# EAGLE design Fingerprint lock_1.4 (EAGLE 9.6.2)

## Sheet 1 of 2
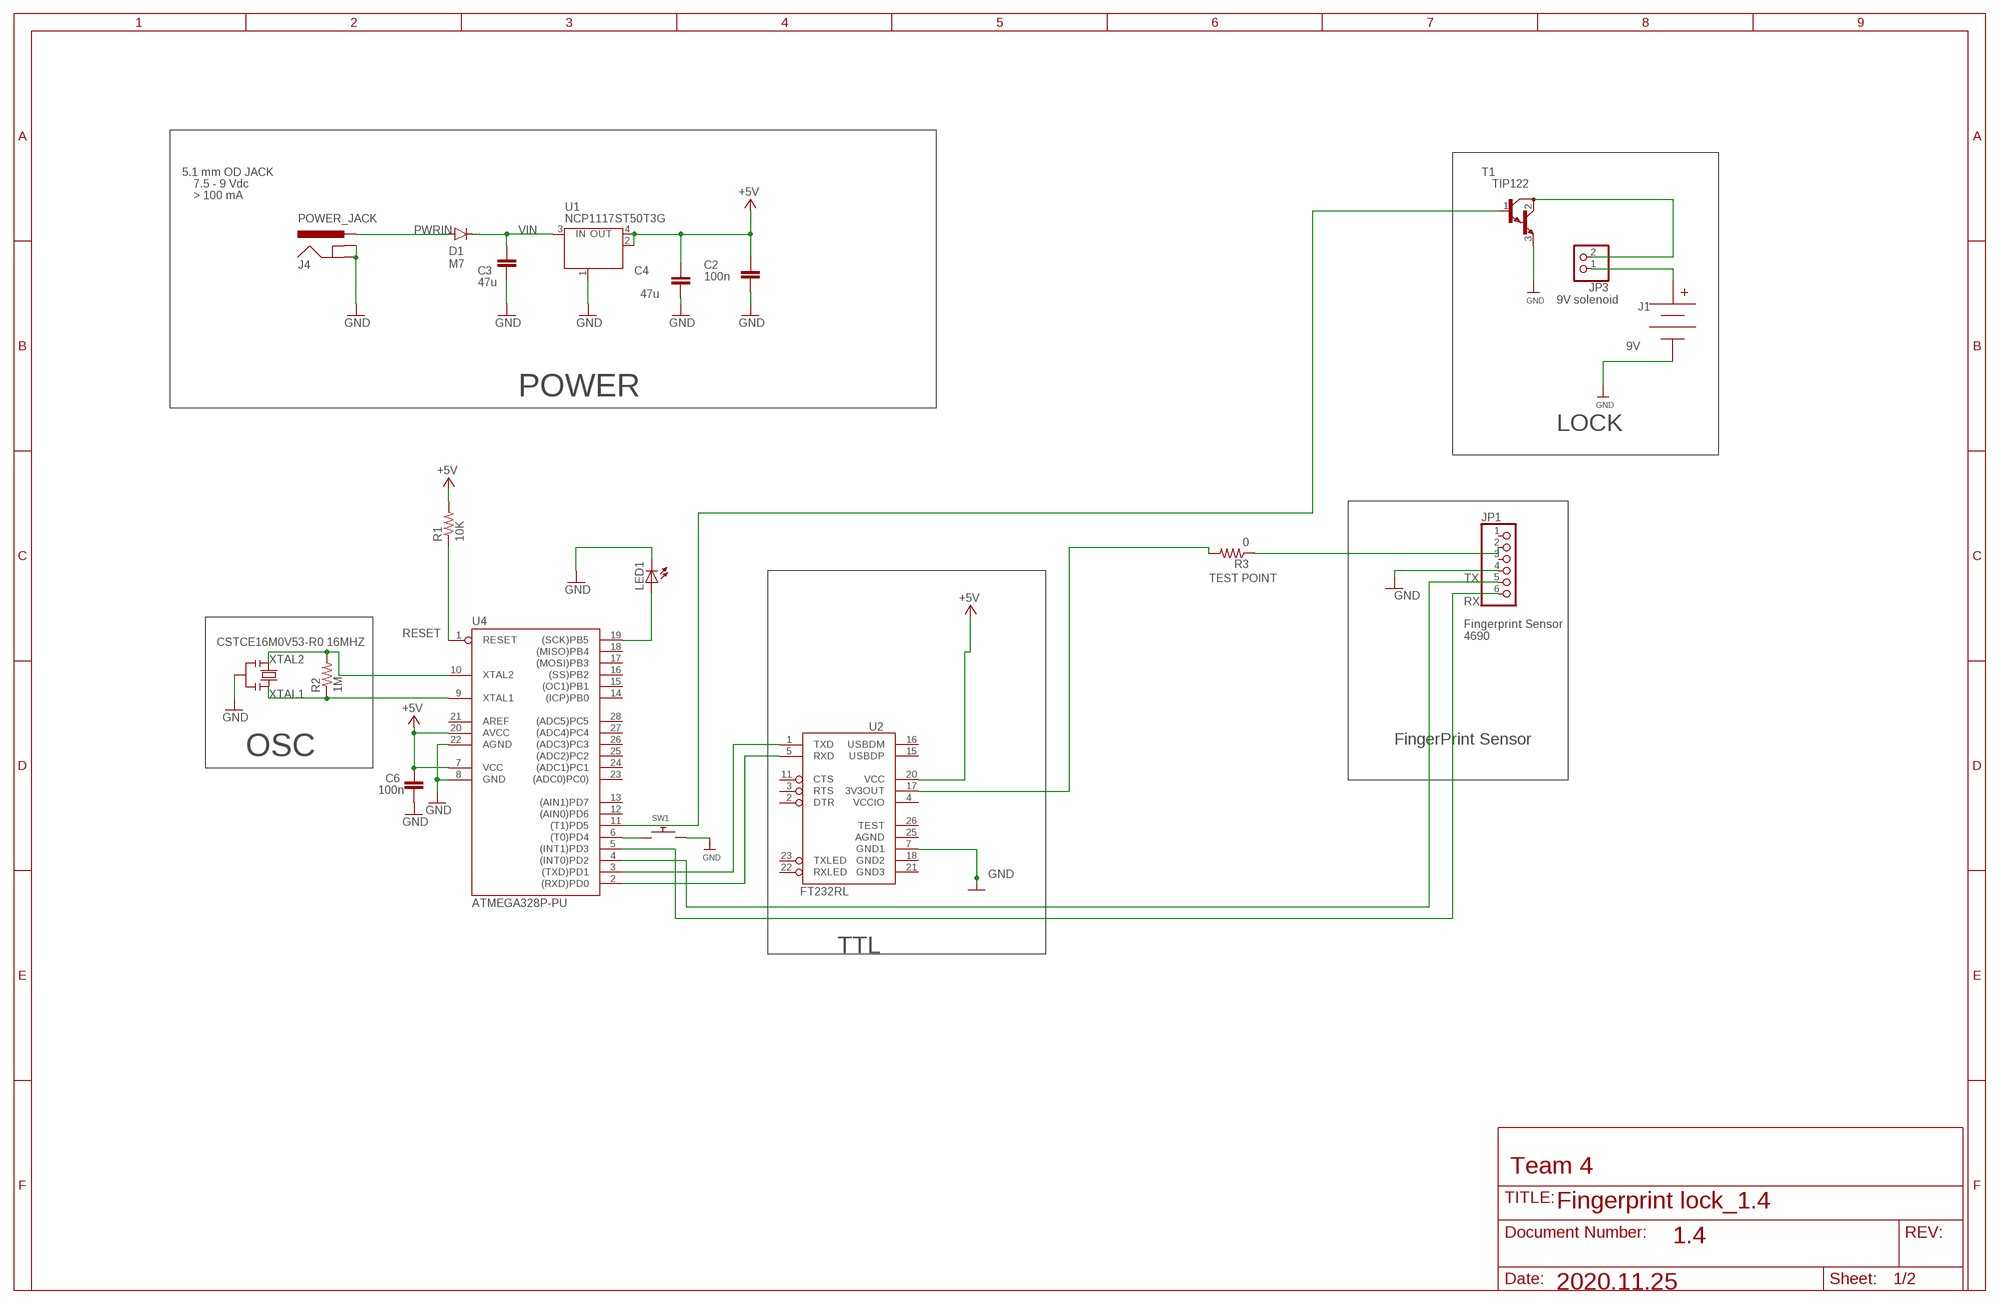
[diagram p0: schematic, sheet 1]

### Parts
C2  100n  C-EUC0805  [C0805]
C3  47u  C-EUC0805  [C0805]
C4  47u  C-EUC0805  [C0805]
C6  100n  C-EUC0805  [C0805]
D1  M7  DIODE-SMB  [SMB]
J1  9V  BC9VPC  [BC9VPC]
J4  POWER_JACK  [POWER_JACK_PTH]
JP1  PINHD-1X6B  [1X06-BIG]
JP3  PINHD-1X2  [1X02]
LED1  LEDB155  [Q62902-B155]
R1  10K  R-US_R0805  [R0805]
R2  1M  R-US_R0805  [R0805]
R3  0  R-US_R0805  [R0805]
SW1  SWITCH_PUSHBUTTONEVQ-PE  [TACT_PANA-EVQ]
T1  TIP122  [TO220]
U1  NCP1117ST50T3G  MC33269ST-3.3T3  [SOT223]
U2  FT232RL  FT232RL-BASICSSOP  [SSOP28DB]
U4  ATMEGA328P-PU  [DIL28-3]
X1  CSTCE16M0V53-R0 16MHZ  RESONATORMU  [RESONATOR]

### Nets
9V: J1.V+ JP3.1
+5V: C2.2 C4.2 C6.2 R1.2 U1.2(OUT) U1.4(OUT) U2.20(VCC) U4.7(VCC) U4.20(AVCC)
GND [gnd]: C2.1 C3.1 C4.1 C6.1 J1.V- J4.GND J4.GNDBREAK JP1.4 LED1.K(C) SW1.P$2 T1.3(E) U1.1(GND/ADJ) U2.7(GND1) U4.8(GND) U4.22(AGND) X1.2
LED: LED1.A U4.19((SCK)PB5)
LOCK: T1.1(B) U4.11((T1)PD5)
N$1: JP1.6 U4.5((INT1)PD3)
N$2: JP1.2 R3.1
N$3: U2.5(RXD) U4.2((RXD)PD0)
N$4: U2.1(TXD) U4.3((TXD)PD1)
N$5: R3.2 U2.17(3V3OUT)
N$6: JP3.2 T1.2(C)
N$7: SW1.P$1 U4.6((T0)PD4)
PWRIN [power]: D1.A J4.PWR
RESET: R1.1 U4.1(RESET)
TXD: JP1.5 U4.4((INT0)PD2)
VIN [power]: C3.2 D1.C U1.3(IN)
XTAL1: R2.1 U4.9(XTAL1) X1.3
XTAL2: R2.2 U4.10(XTAL2) X1.1
Unconnected: JP1.1 JP1.3 U2.2(DTR) U2.3(RTS) U2.11(CTS) U2.15(USBDP) U2.16(USBDM) U2.22(RXLED) U2.23(TXLED) U2.26(TEST) U4.12((AIN0)PD6) U4.13((AIN1)PD7) U4.14((ICP)PB0) U4.15((OC1)PB1) U4.16((SS)PB2) U4.17((MOSI)PB3) U4.18((MISO)PB4) U4.21(AREF) U4.23((ADC0)PC0)) U4.24((ADC1)PC1) U4.25((ADC2)PC2) U4.26((ADC3)PC3) U4.27((ADC4)PC4) U4.28((ADC5)PC5)

### Notes on the sheet
- 5.1 mm OD JACK
- 7.5 - 9 Vdc
- > 100 mA
- 9V solenoid
- POWER
- LOCK
- TEST POINT | TX
- RX
- Fingerprint Sensor   
  4690
- FingerPrint Sensor
- OSC
- TTL
- Team 4
- Fingerprint lock_1.4
- 1.4
- 2020.11.25

## Sheet 2 of 2

## Power pins joined to a net without a drawn wire
AGND: U2.25(AGND)
GND2: U2.18(GND2)
GND3: U2.21(GND3)
VCCIO: U2.4(VCCIO)

## Library data of the parts
C2-C4 C6 = rcl:C-EU: CAPACITOR, European symbol; SPICEPREFIX: C
D1 = diode:DIODE-: DIODE
J1 = SparkFun-Connectors:BC9VPC: 9V Battery Holder - PC Mount Standard and Kit footprints included SparkFun Products: SparkFun SparkPunk Sound Kit <https://www.sparkfun.com/products/11177> SparkFun SparkPunk Sequencer Kit <https://www.sparkfun.com/products/12707>; PROD_ID: BATT-10855
J4 = SparkFun-Connectors:POWER_JACK: Power Jack Connector This is the standard 5.5mm barrel jack for power. The PTH is the most common, proven, reliable, footprint. The Slot footprint only works if the mill layer is transmitted to the PCB fab house so be warned. Here are the connectors we sell at SparkFun: DC Barrel Power Jack/Connector <https://www.sparkfun.com/products/119> (PRT-00119) DC Barrel Power Jack/Connector (SMD) <https://www.sparkfun.com/products/12748> (PRT-12748) DC Barrel Jack Adapter - Breadboard Compatible <https://www.sparkfun.com/products/10811> (PRT-10811) It is used on this SparkFun product (and many, many others): SparkFun RedBoard - Programmed with Arduino <https://www.sparkfun.com/products/12757> (DEV-12757) Also, if you need a mating power supply or connector, please check these out: Wall Adapter Power Supply - 9VDC 650mA <https://www.sparkfun.com/products/298> (TOL-00298) DC Barrel Jack Adapter - Male <https://www.sparkfun.com/products/10287> (PRT-10287); PROD_ID: CONN-08197
JP1 = adafruit:PINHD-1X6: PIN HEADER
JP3 = pinhead:PINHD-1X2: PIN HEADER
LED1 = adafruit:LED: LED OSRAM: - CHIPLED LG R971, LG N971, LY N971, LG Q971, LY Q971, LO R971, LY R971 LH N974, LH R974 LS Q976, LO Q976, LY Q976 LO Q996 - Hyper CHIPLED LW Q18S LB Q993, LB Q99A, LB R99A - SideLED LS A670, LO A670, LY A670, LG A670, LP A670 LB A673, LV A673, LT A673, LW A673 LH A674 LY A675 LS A676, LA A676, LO A676, LY A676, LW A676 LS A679, LY A679, LG A679 - Hyper Micro SIDELED® LS Y876, LA Y876, LO Y876, LY Y876 LT Y87S - SmartLED LW L88C, LW L88S LB L89C, LB L89S, LG L890 LS L89K, LO L89K, LY L89K LS L896, LA L896, LO L896, LY L896 - TOPLED LS T670, LO T670, LY T670, LG T670, LP T670 LSG T670, LSP T670, LSY T670, LOP T670, LYG T670 LG T671, LOG T671, LSG T671 LB T673, LV T673, LT T673, LW T673 LH T674 LS T676, LA T676, LO T676, LY T676, LB T676, LH T676, LSB T676, LW T676 LB T67C, LV T67C, LT T67C, LS T67K, LO T67K, LY T67K, LW E67C LS E67B, LA E67B, LO E67B, LY E67B, LB E67C, LV E67C, LT E67C LW T67C LS T679, LY T679, LG T679 LS T770, LO T770, LY T770, LG T770, LP T770 LB T773, LV T773, LT T773, LW T773 LH T774 LS E675, LA E675, LY E675, LS T675 LS T776, LA T776, LO T776, LY T776, LB T776 LHGB T686 LT T68C, LB T68C - Hyper Mini TOPLED® LB M676 - Mini TOPLED Santana® LG M470 LS M47K, LO M47K, LY M47K Source: http://www.osram.convergy.de/
R1-R3 = rcl:R-US_: RESISTOR, American symbol; SPICEPREFIX: R
SW1 = adafruit:SWITCH_PUSHBUTTON: Buttons SOFTTOUCHSMD_SJ - Soft touch temporary push button (Super Junk Akihabara) Compatible with SKPMANE010 [Mouser: 688-SKPMAN] C&K_KSS = Digikey: KSS221GLFS
T1 = transistor:TIP122: NPN BIPOLAR DARLINGTON TRANSISTOR
U1 = linear:MC33269ST*: Adjustable Output Low Dropout Voltage Regulator 800 mA Source: http://www.onsemi.com/pub/Collateral/MC33269-D.PDF
U2 = SparkFun-IC-Comms:FT232RL-BASIC: FT232RL USB UART This is the simplified version of the FT232RL unit. Only what you need, nothing you don't. FT232RL 4th Generation USB UART (USB <-> Serial) Controller. Datasheet <http://www.sparkfun.com/datasheets/IC/FT232R_v104.pdf> SparkFun Products Component <https://www.sparkfun.com/products/650> (COM-00650) SparkFun RedBot Mainboard <https://www.sparkfun.com/products/12097> (ROB-12097) SparkFun FTDI Basic Breakout - 5V <https://www.sparkfun.com/products/9716> (DEV-09716) SparkFun FTDI Basic Breakout - 3.3V <https://www.sparkfun.com/products/9873> (DEV-09873) Bus Pirate - v3.6a <https://www.sparkfun.com/products/12942> (TOL-12942) SparkFun USB to Serial Breakout - FT232RL <https://www.sparkfun.com/products/12731> (BOB-12731) SparkFun PicoBoard <https://www.sparkfun.com/products/11888> (WIG-11888) SparkFun RFID USB Reader <https://www.sparkfun.com/products/9963> (SEN-09963) LilyPad FTDI Basic Breakout - 5V <https://www.sparkfun.com/products/10275> (DEV-10275) SparkFun Stepoko <https://www.sparkfun.com/products/13899> (ROB-13899); PROD_ID: IC-00870
U4 = SmartPrj:ATMEGA328P-: MICROCONTROLLER 4 Kbytes FLASH 128 bytes SRAM 256 bytes EEPROM UART 6-channel 10 bit ADC
X1 = SmartPrj:RESONATOR

## Net classes
0 default: width 0.254 mm, clearance 0.254 mm
1 power: width 0.61 mm, drill 0.61 mm, clearance 0.254 mm
2 gnd: width 0.305 mm, drill 0.559 mm, clearance 0.254 mm
3 usbvcc: width 0.508 mm, drill 0.61 mm, clearance 0.254 mm

## Board
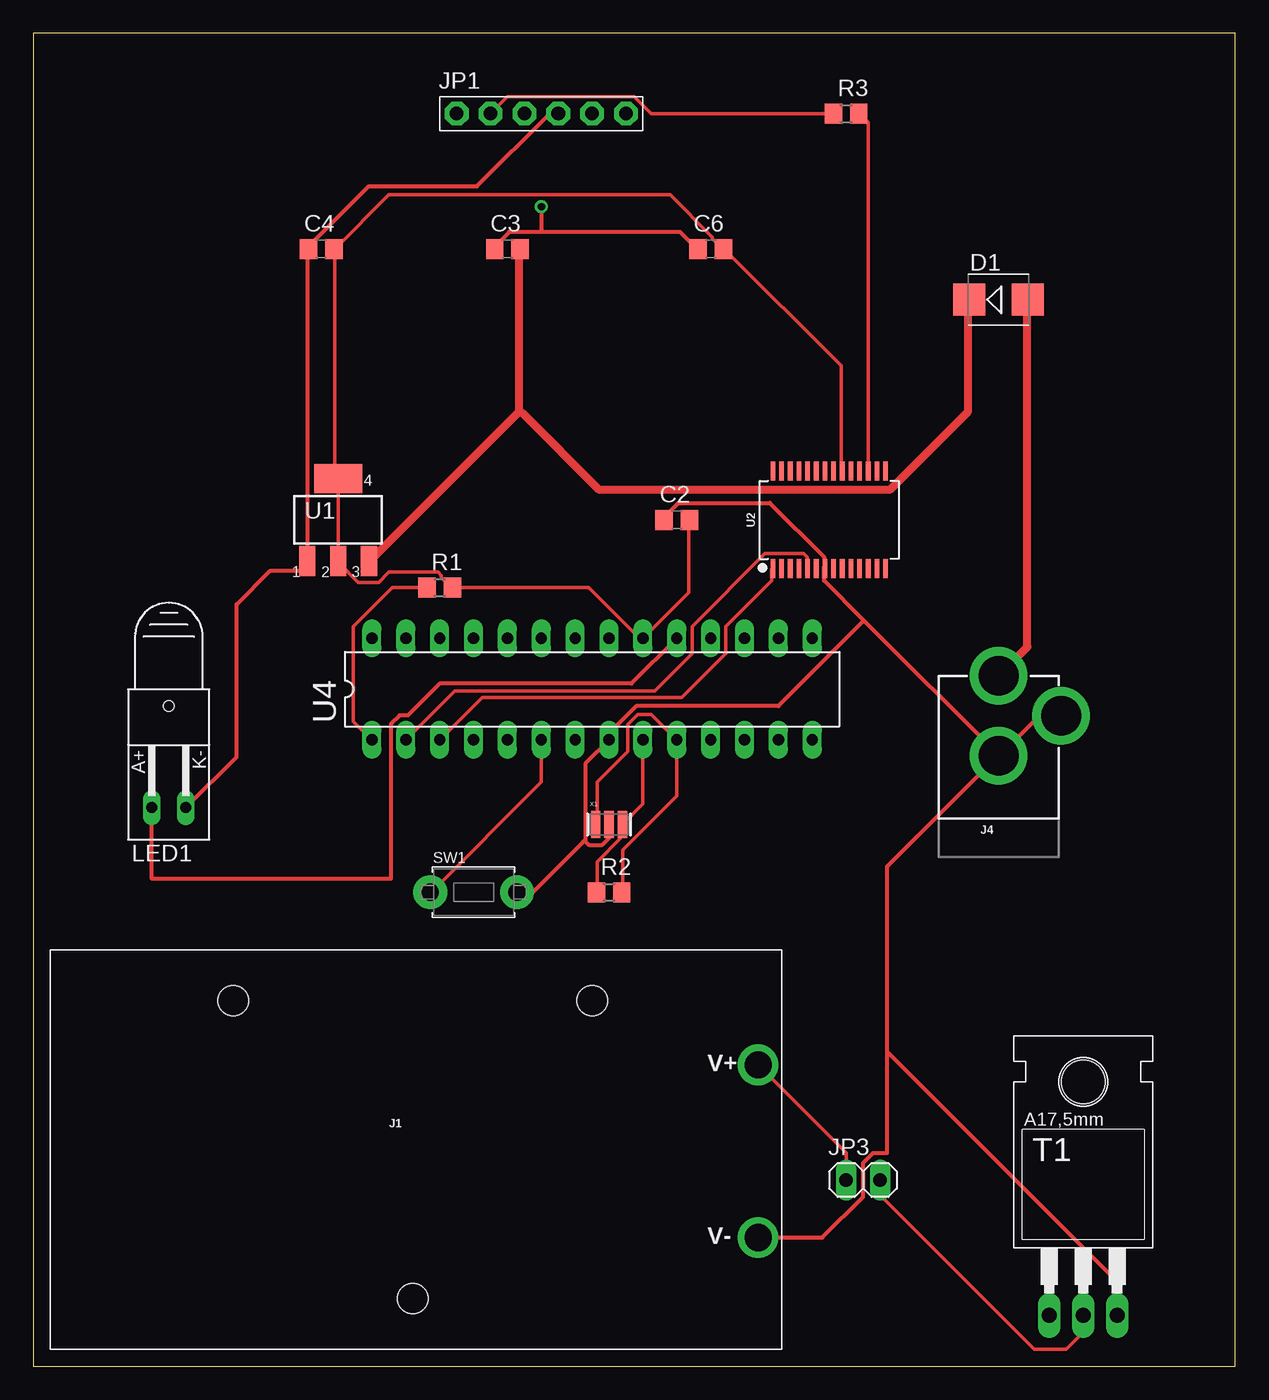
[diagram p1: board, top side]
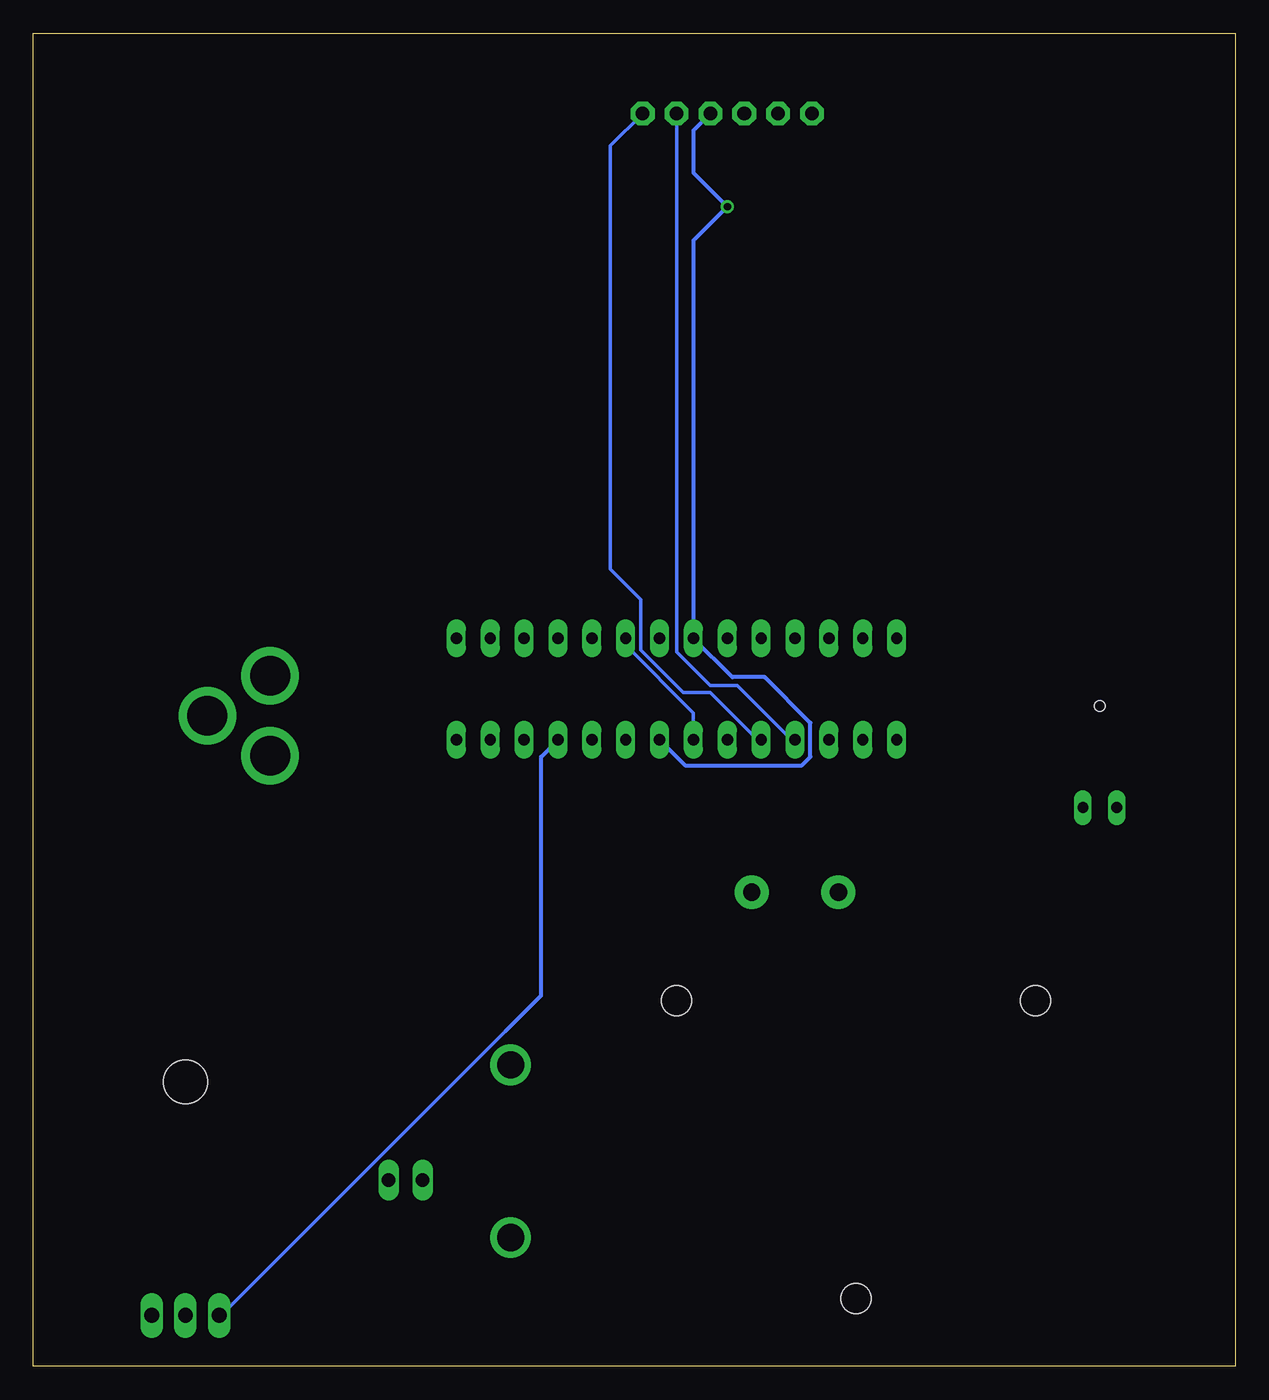
[diagram p2: board, bottom side, seen from below]

Size 90.15 x 100 mm. Coordinates in mm from the lower left corner, seen from the top.
Outline: 0,0 90.15,0 90.15,100 0,100 0,0
Copper layers (1+2*15+16): Top 0.035mm / dielectric 1.5mm / Route2 0.035mm / dielectric 0.15mm / Route15 0.035mm / dielectric 0.2mm / Bottom 0.035mm
Design rules "default *": minimum track width 6mil, minimum drill 0.35mm, track to track 6mil, track to pad 6mil, pad to pad 6mil, via to via 6mil, smd to smd 6mil, copper to edge 40mil, drill to drill 6mil, minimum pad ring 10mil, minimum via ring 8mil, stop-mask expansion 4mil, vias tented up to drill 0mil, thermal gap 10mil

### Footprints (pad centres in the part's own frame; a part is rotated, then mirrored left to right if it is on the bottom)
C0805 = smd 1.3 x 1.5: 1 -0.95,0; 2 0.95,0
SMB = smd 2.4 x 2.4: A 2.2,0; C -2.2,0
BC9VPC = drill 2.032: V+ 53.086,21.336; V- 53.086,8.382 | hole 2.286: 27.178,3.81; 13.716,26.162; 40.64,26.162
POWER_JACK_PTH = drill 2.997 pad 4.318: GND 0,7.7; GNDBREAK 4.7,10.7; PWR 0,13.7
1X06-BIG = drill 1.016 pad 1.778 octagon: 1 -6.35,0; 2 -3.81,0; 3 -1.27,0; 4 1.27,0; 5 3.81,0; 6 6.35,0
1X02 = drill 1.016 long: 1 -1.27,0; 2 1.27,0
Q62902-B155 = drill 0.813 long: A 7.62,-1.27; K 7.62,1.27 | hole 0.813: 0,0
R0805 = smd 1.3 x 1.5: 1 -0.95,0; 2 0.95,0
TACT_PANA-EVQ = drill 1.3 pad 2.54: P$1 -3.25,0; P$2 3.25,0
TO220 = drill 1.118 long: 1 -2.54,-6.35; 2 0,-6.35; 3 2.54,-6.35 | hole 3.302: 0,11.176
SOT223 = smd 1.219 x 2.235: 1 -2.311,-3.099; 2 0,-3.099; 3 2.311,-3.099 | smd 3.6 x 2.2: 4 0,3.099
SSOP28DB = smd 0.348 x 1.397: 1 -4.225,-3.656; 2 -3.575,-3.656; 3 -2.925,-3.656; 4 -2.275,-3.656; 5 -1.625,-3.656; 6 -0.975,-3.656; 7 -0.325,-3.656; 8 0.325,-3.656; 9 0.975,-3.656; 10 1.625,-3.656; 11 2.275,-3.656; 12 2.925,-3.656; 13 3.575,-3.656; 14 4.225,-3.656; 15 4.225,3.656; 16 3.575,3.656; 17 2.925,3.656; 18 2.275,3.656; 19 1.625,3.656; 20 0.975,3.656; 21 0.325,3.656; 22 -0.325,3.656; 23 -0.975,3.656; 24 -1.625,3.656; 25 -2.275,3.656; 26 -2.925,3.656; 27 -3.575,3.656; 28 -4.225,3.656
DIL28-3 = drill 0.85 pad 1.422 long: 1 -16.51,-3.81; 2 -13.97,-3.81; 3 -11.43,-3.81; 4 -8.89,-3.81; 5 -6.35,-3.81; 6 -3.81,-3.81; 7 -1.27,-3.81; 8 1.27,-3.81; 9 3.81,-3.81; 10 6.35,-3.81; 11 8.89,-3.81; 12 11.43,-3.81; 13 13.97,-3.81; 14 16.51,-3.81; 15 16.51,3.81; 16 13.97,3.81; 17 11.43,3.81; 18 8.89,3.81; 19 6.35,3.81; 20 3.81,3.81; 21 1.27,3.81; 22 -1.27,3.81; 23 -3.81,3.81; 24 -6.35,3.81; 25 -8.89,3.81; 26 -11.43,3.81; 27 -13.97,3.81; 28 -16.51,3.81
RESONATOR = smd 0.7 x 2: 1 -1,0; 2 0,0; 3 1,0

### Placement (x,y rotation side)
C2  48.26,63.5 0 top
C3  35.56,83.82 0 top
C4  21.59,83.82 0 top
C6  50.8,83.82 0 top
D1  72.39,80.01 0 top
J1  1.27,1.27 0 top
J4  72.39,38.1 0 top
JP1  38.1,93.98 0 top
JP3  62.23,13.97 0 top
LED1  10.16,49.53 270 top
R1  30.48,58.42 0 top
R2  43.18,35.56 0 top
R3  60.96,93.98 0 top
SW1  33.02,35.56 0 top
T1  78.74,10.16 0 top
U1  22.86,63.5 0 top
U2  59.69,63.5 0 top
U4  41.91,50.8 0 top
X1  43.18,40.64 0 top

### Tracks (layer width: path | path; a pad name or v marks a point on that pad's centre or on a via)
9V
  Top 0.254: JP3.1 60.96,16 J1.V+
+5V
  Top 0.254: C2.2 49.15,63.5 49.15,58.04 U4.20 45.72,54.74 45.34,54.74 41.66,58.42 R1.2 31.37,58.42 30.61,59.18 30.61,59.31 30.35,59.56 26.67,59.56 25.91,58.8 24.38,58.8 22.86,60.33 U1.2 U1.4 22.86,66.67 22.61,66.93 22.61,83.82 | U2.20 60.58,67.18 60.58,75.06 51.82,83.82 C6.2 51.69,83.82 50.93,84.58 50.93,84.71 47.75,87.88 26.67,87.88 22.61,83.82 | 22.61,83.82 C4.2
  Bottom 0.254: U4.7 40.64,49.02 45.72,54.1 U4.20
GND  (via drill 0.56)
  Top 0.305: 38.1,85.09 48.51,85.09 49.78,83.82 C6.1 | 38.1,85.09 35.69,85.09 34.67,84.07 34.67,83.82 C3.1 | JP1.4 38.73,93.98 33.27,88.52 25.15,88.52 20.57,83.95 C4.1 20.57,83.82 20.57,60.45 U1.1 20.45,60.33 20.32,60.2 20.32,59.69 17.78,59.69 15.24,57.15 15.24,45.72 LED1.K | v38.1,87 38.1,85.09 | T1.3 81.28,6.35 64.01,23.62 | J1.V- 59.18,9.65 62.23,12.7 62.23,15.24 62.99,16 64.01,16 64.01,23.62 | X1.2 43.18,39.62 42.67,39.12 41.66,39.12 41.4,39.37 | 41.4,39.37 41.4,45.21 U4.8 43.18,47.5 45.21,49.53 55.88,49.53 62.29,55.94 | C2.1 47.37,63.5 47.37,63.75 48.39,64.77 55.24,64.77 59.31,60.71 59.31,59.94 U2.7 59.31,59.82 59.31,58.93 62.29,55.94 | 62.29,55.94 72.39,45.85 J4.GND | J4.GNDBREAK 77.09,48.77 75.44,48.77 72.52,45.85 J4.GND | 64.01,23.62 64.01,37.47 72.26,45.72 J4.GND | SW1.P$2 37.47,35.56 41.27,39.37 41.4,39.37
  Bottom 0.305: JP1.4 40.64,92.71 40.64,89.53 v38.1,87 40.64,84.45 U4.22 37.72,51.69 35.31,51.69 31.88,48.26 31.88,45.72 32.51,45.09 41.27,45.09 U4.8
LED
  Top 0.305: U4.19 44.86,51.21 30.48,51.21 28.09,48.82 27.48,48.82 26.82,48.16 26.82,36.57 8.89,36.57 LED1.A
LOCK
  Bottom 0.254: T1.1 76.07,3.81 54.74,25.15
  Bottom 0.305: 54.74,25.15 52.07,27.81 52.07,45.72 U4.11
N$1
  Bottom 0.254: U4.5 35.81,46.99 39.37,50.55 41.4,50.55 44.58,53.72 44.58,57.53 46.86,59.82 46.86,91.57 JP1.6
N$2
  Top 0.254: R3.1 46.35,93.98 45.09,95.25 35.56,95.25 JP1.2
N$3
  Top 0.254: U4.2 31.62,50.67 46.61,50.67 49.4,53.47 49.4,55.5 54.86,60.96 57.78,60.96 58.04,60.71 58.04,59.94 U2.5
N$4
  Top 0.254: U4.3 33.66,50.16 48.64,50.16 51.94,53.47 51.94,55.5 55.37,58.93 55.37,59.82 U2.1
N$5
  Top 0.254: U2.17 62.61,67.18 62.61,93.34 61.98,93.98 R3.2
N$6
  Top 0.254: JP3.2 63.5,12.83 75.06,1.27 77.47,1.27 78.74,2.54 T1.2
N$7
  Top 0.254: U4.6 38.1,43.81 29.84,35.56 SW1.P$1
PWRIN
  Top 0.61: D1.A 74.55,80.01 74.55,53.98 72.39,51.82 J4.PWR
RESET
  Top 0.254: U4.1 24,48.39 24,55.5 26.92,58.42 R1.1
TXD
  Bottom 0.254: U4.4 33.27,46.99 37.34,51.05 39.37,51.05 41.91,53.59 JP1.5
VIN
  Top 0.61: 36.45,71.63 36.45,83.82 C3.2 | 36.45,71.63 25.27,60.45 U1.3 | D1.C 70.1,80.01 70.1,71.63 64.26,65.79 42.42,65.79 36.7,71.5 36.45,71.63
XTAL1
  Top 0.254: R2.1 42.29,35.56 42.29,37.85 44.07,39.62 44.07,40.64 X1.3 44.2,40.64 45.72,42.16 U4.9
XTAL2
  Top 0.254: R2.2 44.2,35.56 44.2,38.73 48.26,42.8 U4.10 46.35,48.9 45.34,48.9 44.58,48.13 44.58,46.1 42.29,43.81 42.29,40.64 X1.1